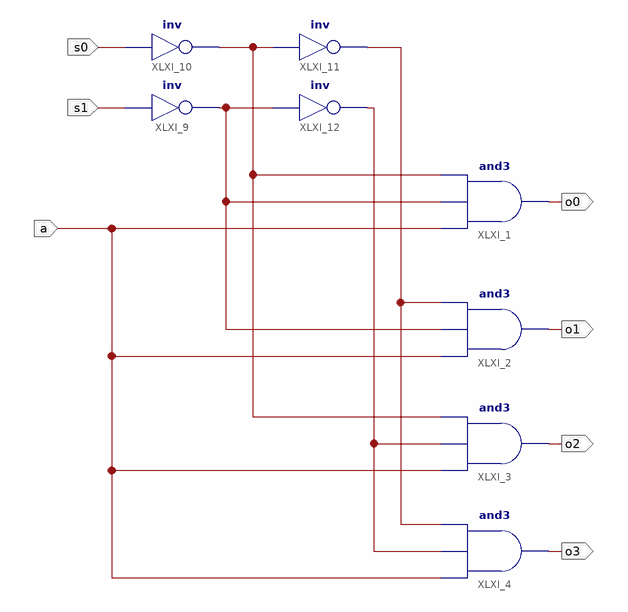
[diagram p0: schematic sheet 1]
// Xilinx ISE schematic Demux1to4.sch (spartan3e) as structural Verilog: 8 symbols, 7 ports
module Demux1to4 (
  input  s0,
  input  s1,
  input  a,
  output o0,
  output o1,
  output o2,
  output o3
);

  wire XLXN_16, XLXN_21, XLXN_23, XLXN_25;

  and XLXI_1 (o0, a, XLXN_21, XLXN_16);
  and XLXI_2 (o1, a, XLXN_21, XLXN_23);
  and XLXI_3 (o2, a, XLXN_25, XLXN_16);
  and XLXI_4 (o3, a, XLXN_25, XLXN_23);
  not XLXI_9 (XLXN_21, s1);
  not XLXI_10 (XLXN_16, s0);
  not XLXI_11 (XLXN_23, XLXN_16);
  not XLXI_12 (XLXN_25, XLXN_21);
endmodule
